# EAGLE schematic RedFly-Shield_v13 (EAGLE 6.6.0)
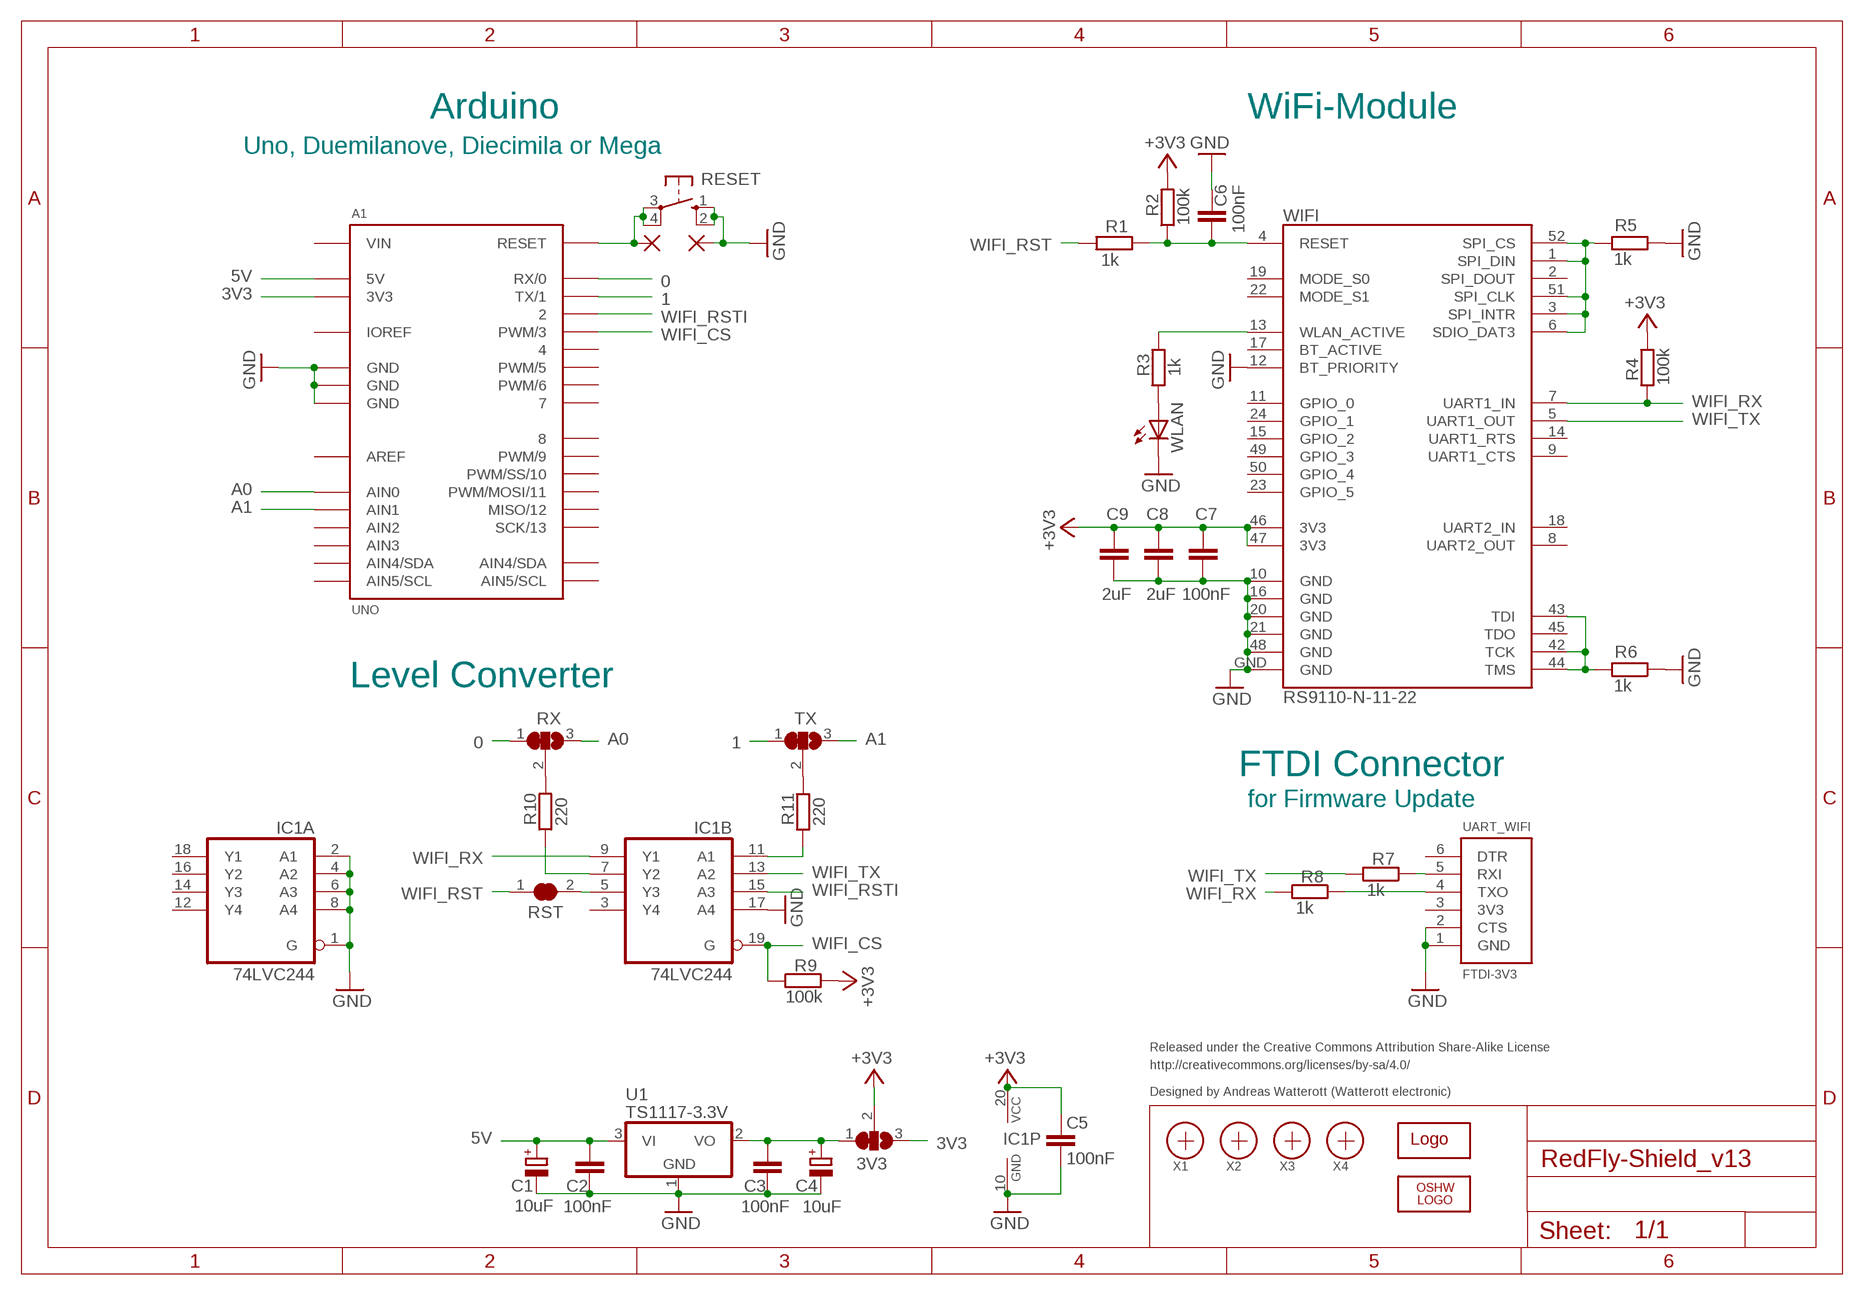
[diagram p0: schematic, sheet 1]

## Parts
3V3  SJ2W  [SJ_2]
A1  UNO  [UNO]
C1  10uF  CPOL-EU153CLV-0505  [153CLV-0505]
C2  100nF  C-EUC0603  [C0603]
C3  100nF  C-EUC0603  [C0603]
C4  10uF  CPOL-EU153CLV-0505  [153CLV-0505]
C5  100nF  C-EUC0603  [C0603]
C6  100nF  C-EUC0603  [C0603]
C7  100nF  C-EUC0603  [C0603]
C8  2uF  C-EUC0603  [C0603]
C9  2uF  C-EUC0603  [C0603]
GND  SMD2  [SMD1,27-2,54]
IC1  74LVC244  74HC244DW  [SO20W]
LOGO1  OSHW_LOGO_6MILX0100-NT  [OSHW_6X100_NOTEXT]
R1  1k  R-EU_R0603  [R0603]
R2  100k  R-EU_R0603  [R0603]
R3  1k  R-EU_R0603  [R0603]
R4  100k  R-EU_R0603  [R0603]
R5  1k  R-EU_R0603  [R0603]
R6  1k  R-EU_R0603  [R0603]
R7  1k  R-EU_R0603  [R0603]
R8  1k  R-EU_R0603  [R0603]
R9  100k  R-EU_R0603  [R0603]
R10  220  R-EU_R0603  [R0603]
R11  220  R-EU_R0603  [R0603]
RESET  10-XX  [B3F-10XX]
RST  SJ  [SJ]
RST2  SMD2  [SMD1,27-2,54]
RX  SJ2W  [SJ_2]
TX  SJ2W  [SJ_2]
U1  TS1117-3.3V  TS1117  [SOT223]
U$1  WE-LOGO  [WE-LOGO]
UART_WIFI  FTDI-3V3  FTDI  [FTDI]
WIFI  RS9110-N-11-22  RS9110-N-11-21  [RS9110-N-11-21]
WLAN  LEDCHIPLED_0603  [CHIPLED_0603]
X1  PASSER  [PASSER]
X2  PASSER  [PASSER]
X3  PASSER  [PASSER]
X4  PASSER  [PASSER]

## Nets
0: A1.0(RX/0) RX.1
1: A1.1(TX/1) TX.1
3V3: 3V3.3 A1.3V3
3V_OUT: 3V3.1 C3.1 C4.+ U1.2(VO)
5V: A1.5V C1.+ C2.1 U1.3(VI)
+3V3: 3V3.2 C5.1 C7.1 C8.1 C9.1 IC1.20(P:VCC) R2.2 R4.1 R9.2 WIFI.46(3V3) WIFI.47(3V3)
A0: A1.AIN0 RX.3
A1: A1.AIN1 TX.3
GND: A1.GND@1(GND) A1.GND@2(GND) A1.GND@3(GND) C1.- C2.2 C3.2 C4.- C5.2 C6.1 C7.2 C8.2 C9.2 GND.1(P) IC1.1(A:G) IC1.2(A:A1) IC1.4(A:A2) IC1.6(A:A3) IC1.8(A:A4) IC1.10(P:GND) IC1.17(B:A4) R5.1 R6.1 RESET.1(S) RESET.2(S1) U1.1(GND) UART_WIFI.1(GND) UART_WIFI.2(CTS) WIFI.10(GND) WIFI.12(BT_PRIORITY) WIFI.16(GND) WIFI.20(GND) WIFI.21(GND) WIFI.48(GND) WIFI.GND WLAN.C
N$5: R6.2 WIFI.42(TCK) WIFI.43(TDI) WIFI.44(TMS)
N$7: R5.2 WIFI.1(SPI_DIN) WIFI.3(SPI_INTR) WIFI.6(SDIO_DAT3) WIFI.51(SPI_CLK) WIFI.52(SPI_CS)
N$11: R3.1 WIFI.13(WLAN_ACTIVE)
N$12: R3.2 WLAN.A
N$103: R7.1 UART_WIFI.5(RXI)
N$104: R8.1 UART_WIFI.4(TXO)
RST: A1.RST(RESET) RESET.3(P) RESET.4(P1) RST2.1(P)
WIFI_CS: A1.3(PWM/3) IC1.19(B:G) R9.1
WIFI_RST: R1.2 RST.1
WIFI_RST2: C6.2 R1.1 R2.1 WIFI.4(RESET)
WIFI_RSTI: A1.2 IC1.15(B:A3)
WIFI_RSTO: IC1.5(B:Y3) RST.2
WIFI_RX: IC1.9(B:Y1) R4.2 R8.2 WIFI.7(UART1_IN)
WIFI_RX2: R11.1 TX.2
WIFI_RXI: IC1.11(B:A1) R11.2
WIFI_TX: IC1.13(B:A2) R7.2 WIFI.5(UART1_OUT)
WIFI_TX2: R10.2 RX.2
WIFI_TXO: IC1.7(B:Y2) R10.1
Unconnected: A1.4 A1.5(PWM/5) A1.6(PWM/6) A1.7 A1.8 A1.9(PWM/9) A1.10(PWM/SS/10) A1.11(PWM/MOSI/11) A1.12(MISO/12) A1.13(SCK/13) A1.AIN2 A1.AIN3 A1.AIN4(AIN4/SDA) A1.AIN5(AIN5/SCL) A1.SCL(AIN5/SCL) A1.SDA(AIN4/SDA) IC1.3(B:Y4) IC1.12(A:Y4) IC1.14(A:Y3) IC1.16(A:Y2) IC1.18(A:Y1) UART_WIFI.3(3V3) UART_WIFI.6(DTR) WIFI.2(SPI_DOUT) WIFI.8(UART2_OUT) WIFI.9(UART1_CTS) WIFI.11(GPIO_0) WIFI.14(UART1_RTS) WIFI.15(GPIO_2) WIFI.17(BT_ACTIVE) WIFI.18(UART2_IN) WIFI.19(MODE_S0) WIFI.22(MODE_S1) WIFI.23(GPIO_5) WIFI.24(GPIO_1) WIFI.45(TDO) WIFI.49(GPIO_3) WIFI.50(GPIO_4)

## Notes on the sheet
- Arduino | WiFi-Module
- Uno, Duemilanove, Diecimila or Mega
- Level Converter
- FTDI Connector
- for Firmware Update
- Released under the Creative Commons Attribution Share-Alike License
- http://creativecommons.org/licenses/by-sa/4.0/
- Designed by Andreas Watterott (Watterott electronic)

## Power pins joined to a net without a drawn wire
AREF: A1.AREF
IOREF: A1.IOREF
VIN: A1.VIN

## Library data of the parts
3V3 RX TX = jumper:SJ2W: SMD solder JUMPER
A1 = Arduino:UNO
C1 C4 = rcl:CPOL-EU: POLARIZED CAPACITOR, European symbol
C2 C3 C5-C9 = rcl:C-EU: CAPACITOR, European symbol
GND RST2 = wirepad:SMD2: SMD PAD
IC1 = 74xx-eu:74*244: Octal BUFFER and LINE DRIVER, 3-state
LOGO1 = OSHW:OSHW_LOGO_6MIL
R1-R11 = rcl:R-EU_: RESISTOR, European symbol
RESET = switch-omron:10-XX: OMRON SWITCH; MPN: B3F-1000; OC_FARNELL: 176432; OC_NEWARK: 36M3542
RST = jumper:SJ: SMD solder JUMPER
U1 = Voltage-Reg:TS1117
U$1 = welectronic:WE-LOGO
UART_WIFI = Arduino:FTDI: 6pol FTDI Connector
WIFI = RedpineSignals:RS9110-N-11-21: Redpine Signals RS9110-N-11-21
WLAN = led:LED: LED OSRAM: - CHIPLED LG R971, LG N971, LY N971, LG Q971, LY Q971, LO R971, LY R971 LH N974, LH R974 LS Q976, LO Q976, LY Q976 LO Q996 - Hyper CHIPLED LW Q18S LB Q993, LB Q99A, LB R99A - SideLED LS A670, LO A670, LY A670, LG A670, LP A670 LB A673, LV A673, LT A673, LW A673 LH A674 LY A675 LS A676, LA A676, LO A676, LY A676, LW A676 LS A679, LY A679, LG A679 - Hyper Micro SIDELED® LS Y876, LA Y876, LO Y876, LY Y876 LT Y87S - SmartLED LW L88C, LW L88S LB L89C, LB L89S, LG L890 LS L89K, LO L89K, LY L89K LS L896, LA L896, LO L896, LY L896 - TOPLED LS T670, LO T670, LY T670, LG T670, LP T670 LSG T670, LSP T670, LSY T670, LOP T670, LYG T670 LG T671, LOG T671, LSG T671 LB T673, LV T673, LT T673, LW T673 LH T674 LS T676, LA T676, LO T676, LY T676, LB T676, LH T676, LSB T676, LW T676 LB T67C, LV T67C, LT T67C, LS T67K, LO T67K, LY T67K, LW E67C LS E67B, LA E67B, LO E67B, LY E67B, LB E67C, LV E67C, LT E67C LW T67C LS T679, LY T679, LG T679 LS T770, LO T770, LY T770, LG T770, LP T770 LB T773, LV T773, LT T773, LW T773 LH T774 LS E675, LA E675, LY E675, LS T675 LS T776, LA T776, LO T776, LY T776, LB T776 LHGB T686 LT T68C, LB T68C - Hyper Mini TOPLED® LB M676 - Mini TOPLED Santana® LG M470 LS M47K, LO M47K, LY M47K Source: http://www.osram.convergy.de LUXEON: - LUMILED® LXK2-PW12-R00, LXK2-PW12-S00, LXK2-PW14-U00, LXK2-PW14-V00 LXK2-PM12-R00, LXK2-PM12-S00, LXK2-PM14-U00 LXK2-PE12-Q00, LXK2-PE12-R00, LXK2-PE12-S00, LXK2-PE14-T00, LXK2-PE14-U00 LXK2-PB12-K00, LXK2-PB12-L00, LXK2-PB12-M00, LXK2-PB14-N00, LXK2-PB14-P00, LXK2-PB14-Q00 LXK2-PR12-L00, LXK2-PR12-M00, LXK2-PR14-Q00, LXK2-PR14-R00 LXK2-PD12-Q00, LXK2-PD12-R00, LXK2-PD12-S00 LXK2-PH12-R00, LXK2-PH12-S00 LXK2-PL12-P00, LXK2-PL12-Q00, LXK2-PL12-R00 Source: www.luxeon.com KINGBRIGHT: KA-3528ASYC Source: www.kingbright.com
X1-X4 = SMD:PASSER